# Altium schematic sheet WiCam_ADC.SchDoc
size B
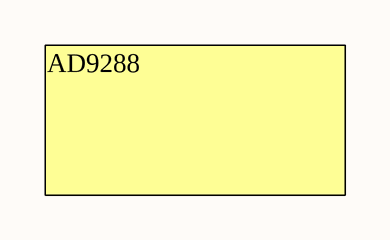
[diagram p0: WiCam_ADC.SchDoc]

## Notes on the sheet
- AD9288